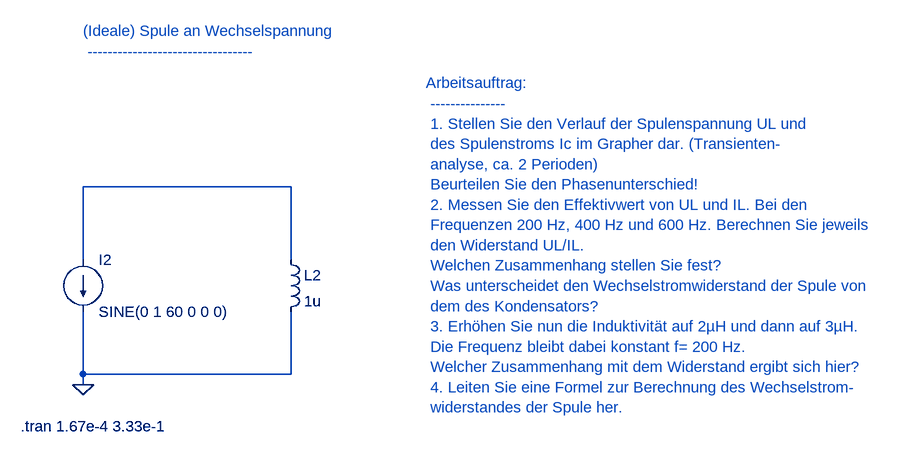
[diagram p0: schematic 10_4_L_an_Wechselspannung.asc]
10_4_L_an_Wechselspannung.asc, the LTspice schematic file:
Version 4
SHEET 1 880 680
WIRE 160 512 160 528
WIRE 480 512 480 608
WIRE 480 608 160 608
WIRE 160 608 160 624
WIRE 160 528 160 608
WIRE 160 432 160 320
WIRE 160 320 480 320
WIRE 480 320 480 432
FLAG 160 624 0
SYMBOL ind 464 416 R0
SYMATTR InstName L2
SYMATTR Value 1u
SYMBOL current 160 432 R0
SYMATTR InstName I2
SYMATTR Value SINE(0 1 60 0 0 0)
TEXT 64 688 Left 2 !.tran 1.67e-4 3.33e-1
TEXT 160 80 Left 2 ;(Ideale) Spule an Wechselspannung \n ---------------------------------
TEXT 688 160 Left 2 ;Arbeitsauftrag: \n --------------- \n 1. Stellen Sie den Verlauf der Spulenspannung UL und \n des Spulenstroms Ic im Grapher dar. (Transienten- \n analyse, ca. 2 Perioden) \n Beurteilen Sie den Phasenunterschied! \n 2. Messen Sie den Effektivwert von UL und IL. Bei den \n Frequenzen 200 Hz, 400 Hz und 600 Hz. Berechnen Sie jeweils \n den Widerstand UL/IL. \n Welchen Zusammenhang stellen Sie fest? \n Was unterscheidet den Wechselstromwiderstand der Spule von \n dem des Kondensators? \n 3. Erhöhen Sie nun die Induktivität auf 2µH und dann auf 3µH. \n Die Frequenz bleibt dabei konstant f= 200 Hz. \n Welcher Zusammenhang mit dem Widerstand ergibt sich hier? \n 4. Leiten Sie eine Formel zur Berechnung des Wechselstrom- \n widerstandes der Spule her.

The netlist it stands for:
* 10_4_L_an_Wechselspannung.asc
L2 N001 0 1u
I2 N001 0 SINE(0 1 60 0 0 0)
.tran 1.67e-4 3.33e-1
* (Ideale) Spule an Wechselspannung
*  ---------------------------------
* Arbeitsauftrag:
*  ---------------
*  1. Stellen Sie den Verlauf der Spulenspannung UL und
*  des Spulenstroms Ic im Grapher dar. (Transienten-
*  analyse, ca. 2 Perioden)
*  Beurteilen Sie den Phasenunterschied!
*  2. Messen Sie den Effektivwert von UL und IL. Bei den
*  Frequenzen 200 Hz, 400 Hz und 600 Hz. Berechnen Sie jeweils
*  den Widerstand UL/IL.
*  Welchen Zusammenhang stellen Sie fest?
*  Was unterscheidet den Wechselstromwiderstand der Spule von
*  dem des Kondensators?
*  3. Erhöhen Sie nun die Induktivität auf 2µH und dann auf 3µH.
*  Die Frequenz bleibt dabei konstant f= 200 Hz.
*  Welcher Zusammenhang mit dem Widerstand ergibt sich hier?
*  4. Leiten Sie eine Formel zur Berechnung des Wechselstrom-
*  widerstandes der Spule her.
.backanno
.end